# Altium schematic sheet POWER.SchDoc
size A
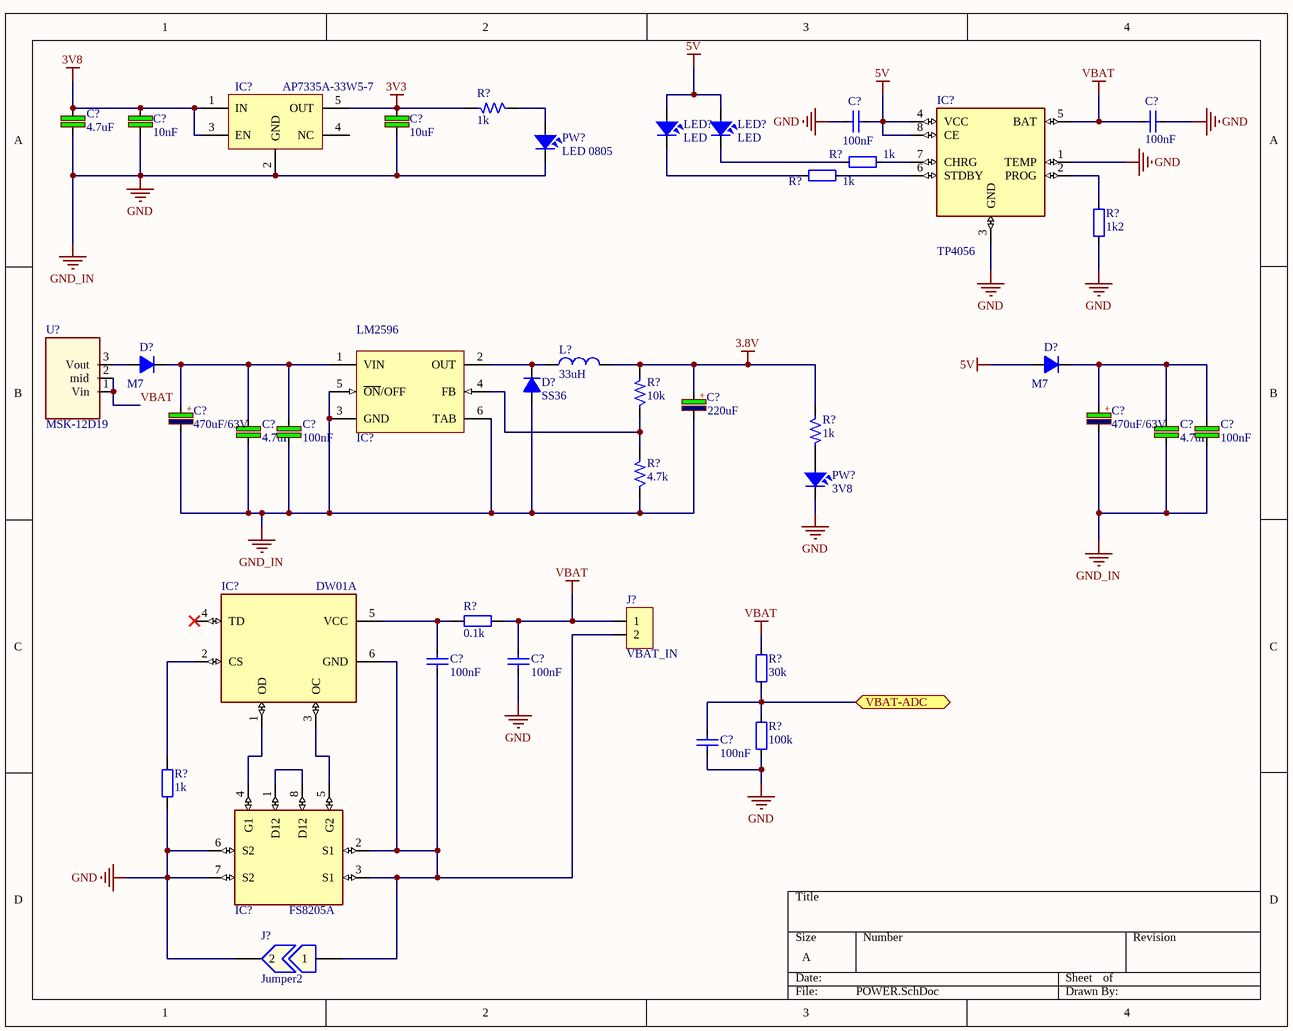
[diagram p0: POWER.SchDoc]

## Parts
(Parts that share a designator on the sheet are numbered #1, #2 ... from top to bottom, then left to right.)
C?#1  4.7uF  [C-0805]
C?#2  10nF  [C-0805]
C?#3  10uF  [C-0805]
C?#4  100nF  [CAP_0805]
C?#5  100nF  [CAP_0805]
C?#6  220uF  [EEFSDE]
C?#7  470uF/63V  [CAP-ALU-SMD-C]
C?#8  470uF/63V  [CAP-ALU-SMD-C]
C?#9  4.7uF  [C-0805]
C?#10  value 100nF  [C-0805]  (hidden comment: 4.7uF)
C?#11  4.7uF  [C-0805]
C?#12  value 100nF  [C-0805]  (hidden comment: 4.7uF)
C?#13  100nF  [CAP_0805]
C?#14  100nF  [CAP_0805]
C?#15  100nF  [CAP_0805]
D?#1  M7  [DIODE SMA]
D?#2  M7  [LED-0805-Blue]
D?#3  SS36  [DIODE SMA]
IC?#1  AP7335A-33W5-7  [SOT23-5]
IC?#2  TP4056  [TP4056]
IC?#3  LM2596  [TO-263]
IC?#4  DW01A  [SOT23-6]
IC?#5  FS8205A  [FS8205A]
J?#1  VBAT_IN  [JP2-D1T]
J?#2  Jumper2  [RES-SMD-0201]
L?  33uH  [Inductor_SMD]
LED?#1  LED  [LED-0805-Red]
LED?#2  LED  [LED-0805-Green]
PW?#1  LED 0805  [LED-0805-Blue]
PW?#2  3V8  [LED-0805-Blue]
R?#1  1k  [R-0805]
R?#2  1k  [RES-SMD-0805]
R?#3  1k  [RES-SMD-0805]
R?#4  1k2  [RES-SMD-0805]
R?#5  10k  [R-0805]
R?#6  1k  [R-0805]
R?#7  4.7k  [R-0805]
R?#8  0.1k  [RES-SMD-0805]
R?#9  30k  [RES-SMD-0805]
R?#10  100k  [RES-SMD-0805]
R?#11  1k  [RES-SMD-0805]
U?  MSK-12D19  [Switch]

## Ports
VBAT-ADC (bidir)

## Nets
3.8V: C?#6.1 L?.2 R?#5.2 R?#6.1
3V3: C?#3.1 IC?#1.5(OUT) R?#1.2
3V8: C?#1.2 C?#2.1 IC?#1.1(IN) IC?#1.3(EN)
5V: C?#4.1 D?#2.1(A) IC?#2.4(VCC) IC?#2.8(CE) LED?#1.1 LED?#2.1
GND: C?#1.1 C?#2.2 C?#3.2 C?#4.2 C?#5.1 C?#6.2 C?#7.2 C?#8.2 C?#9.1 C?#10.1 C?#11.1 C?#12.1 C?#14.1 C?#15.1 D?#3.1(A) IC?#1.2(GND) IC?#2.1(TEMP) IC?#2.3(GND) IC?#3.3(GND) IC?#3.5(~{ON}/OFF) IC?#3.6(TAB) IC?#5.6(S2) IC?#5.7(S2) J?#2.2 PW?#1.2 PW?#2.2 R?#4.1 R?#7.1 R?#10.2 R?#11.2  [also labelled GND_IN]
VBAT: C?#5.2 C?#14.2 IC?#2.5(BAT) J?#1.1 R?#8.2 R?#9.1 U?.1(Vin) U?.2(mid)
VBAT-ADC: C?#15.2 R?#9.2 R?#10.1 ; port VBAT-ADC
NetC?#7_1: C?#7.1 C?#9.2 C?#10.2 D?#1.2(K) IC?#3.1(VIN)
NetC?#8_1: C?#8.1 C?#11.2 C?#12.2 D?#2.2(K)
NetC?#13_1: C?#13.1 IC?#4.6(GND) IC?#5.2(S1) IC?#5.3(S1) J?#1.2 J?#2.1
NetC?#13_2: C?#13.2 IC?#4.5(VCC) R?#8.1
NetD?#1_1: D?#1.1(A) U?.3(Vout)
NetD?#3_2: D?#3.2(K) IC?#3.2(OUT) L?.1
NetIC?#2_2: IC?#2.2(PROG) R?#4.2
NetIC?#2_6: IC?#2.6(STDBY) R?#3.1
NetIC?#2_7: IC?#2.7(CHRG) R?#2.1
NetIC?#3_4: IC?#3.4(FB) R?#5.1 R?#7.2
NetIC?#4_1: IC?#4.1(OD) IC?#5.4(G1)
NetIC?#4_2: IC?#4.2(CS) R?#11.1
NetIC?#4_3: IC?#4.3(OC) IC?#5.5(G2)
NetIC?#5_1: IC?#5.1(D12) IC?#5.8(D12)
NetLED?#1_2: LED?#1.2 R?#3.2
NetLED?#2_2: LED?#2.2 R?#2.2
NetPW?#1_1: PW?#1.1 R?#1.1
NetPW?#2_1: PW?#2.1 R?#6.2

Not connected (* = marked no-connect by the designer): IC?#1 4(NC); IC?#4 4(TD)*

## Notes on the sheet
- (in symbol CP3) +
- (in symbol CP5) +

## Library data of the parts
C?#1 C?#9-C?#12 = C: 4.7µF ±10% 35V Ceramic Capacitor X5R 0805 (2012 Metric); Manufacturer: Samsung Electro-Mechanics; Part number: CL21A475KLCLQNC; User_Description: CAP CER 4.7UF 35V X5R 0805; Category: CAPACITOR; Package: 0805
  C?#1 C?#9 C?#11: Value: 4.7uF
C?#2 = C: Cap SMD; Manufacturer: Samsung Electro-Mechanics; Part number: CL21A106KPFNNNG; Value: 10uF; User_Description: CAP CER 10UF 10V X5R 0805; Category: CAPACITOR; Package: 0805
C?#3 = C: Cap SMD; Manufacturer: Samsung Electro-Mechanics; Part number: CL21A106KPFNNNG; User_Description: CAP CER 10UF 10V X5R 0805; Value: 10uF; Category: CAPACITOR; Package: 0805
C?#4 C?#5 C?#13-C?#15 = CapSMD: Capacitor; Value: 33p; Published: 8-Jun-2000; LatestRevisionDate: 17-Jul-2002; LatestRevisionNote: Re-released for DXP Platform.; PackageReference: RAD-0.3; Publisher: Altium Limited
C?#6 = CP5: 220µF Molded Tantalum Polymer Capacitor 16V 2917 (7343 Metric) 40mOhm @ 100kHz; Manufacturer: AVX Corporation; Part number: TCME227M016R0040E; User_Description: CAP TANT POLY 220UF 16V 2917; Value: 220uF; Category: CAPACITOR; Package: 2917
C?#7 C?#8 = CP3: Cap 470uF/63V; Value: Cap 470uF/63V
D?#1 D?#2 = D1A: Diode 1A; Value: 1N4007
D?#3 = B340A: Diode Schottky 40V 3A Surface Mount DO-214AC (SMA); Manufacturer: Vishay General Semiconductor - Diodes Division; Part number: B340A-M3/61T; User_Description: DIODE SCHOTTKY 40V 3A DO214AC; Value: 40V 3A; Category: DIODE; Package: DO214AC
IC?#2 = TP4056: Complete single cell Li-Ion battery with a constant current / constant voltage linear charger
IC?#3 = LM2576
IC?#4 = DW01A: One Cell Lithium-ion/Polymer Battery Protection IC
J?#1 = JP2: WR-PHD 2.54 mm Angled Socket Header; Manufacturer: W¨¹rth Elektronik eiSos GmbH; partNo: 613002143121; ComponentLink1 Description: Manufacturer; ComponentLink2 Description: Datasheet; NoPins: 02; Created Date: 29 March 2013; ComponentLink1URL: http://www.we-online.com; ComponentLink2URL: http://katalog.we-online.de/em/datasheet/6130xx143121.pdf; Created by: Karrer Zheng
J?#2 = Jumper2: Jumper, 2-Pin
L? = L1: 22µH Shielded Inductor 1.65A 96mOhm Max Nonstandard; Manufacturer: Bourns Inc.; Part Number: SRR0745A-220M; Value: 220uH; User_Description: FIXED IND 22UH 1.65A 96 MOHM SMD; Category: INDUCTORS; Package: SMD
LED?#1 LED?#2 = LED: LED Single colour Green and Red; Value: LED 3 ly Single Colour
PW?#1 PW?#2 = LED: LED RED DIFFUSED 0805 SMD; Manufacturer: OSRAM Opto Semiconductors Inc.; Part number: LS R976-NR-1; Value: Red; Category: LED SMD; Package: 0805; User_Description: LED RED DIFFUSED 0805 SMD
R?#1 R?#6 = R: Resistor 1/4W; Manufacturer: Yageo; Part number: RC0805FR-071KL; User_Description: RES SMD 1K OHM 1% 1/8W 0805; Value: 1k; Category: RESISTORS; Package: 0805
R?#2-R?#4 R?#9 R?#10 = Resistor - SMD: Resistor; Manufacturer: Generic Components; Class: Passive; Published: 08/06/2000; Publisher: Altium Hobart Technology Centre
R?#5 = R: RES SMD 10K OHM 1% 1/8W 0805; Manufacturer: Yageo; Part number: RC0805FR-0710KL; Category: RESISTORS; Package: 0805; User_Description: RES SMD 10K OHM 1% 1/8W 0805; Value: 10k
R?#7 = R: RES SMD 3.3K OHM 1% 1/8W 0805; Manufacturer: Yageo; Part number: RC0805FR-073K3L; Category: RESISTORS; Package: 0805; User_Description: RES SMD 3.3K OHM 1% 1/8W 0805; Value: 3.3k
R?#8 R?#11 = Resistor - SMD: Resistor SMD; Manufacturer: Generic Components; Class: Passive; Published: 08/06/2000; Publisher: Altium Hobart Technology Centre
U? = switch
IC?#1 = AP7335A-33W5-7: Package: SOT23-5; Part number: AP7335A-33W5-7